# Altium schematic sheet Sens.SchDoc
size A4
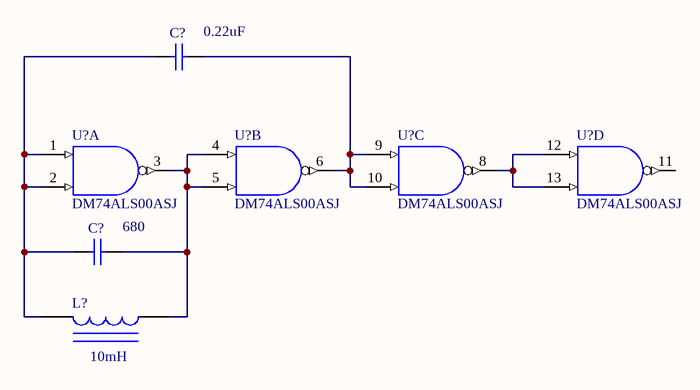
[diagram p0: Sens.SchDoc]

## Parts
(Parts that share a designator on the sheet are numbered #1, #2 ... from top to bottom, then left to right.)
C?#1  value 0.22uF  [RAD-0.3]  (hidden comment: Cap)
C?#2  value 680  [RAD-0.3]  (hidden comment: Cap)
L?  value 10mH  [AXIAL-0.9]  (hidden comment: Inductor Iron)
U?#1  DM74ALS00ASJ  [M14D_N]  (part A of 4)
U?#2  DM74ALS00ASJ  [M14D_N]  (part B of 4)
U?#3  DM74ALS00ASJ  [M14D_N]  (part C of 4)
U?#4  DM74ALS00ASJ  [M14D_N]  (part D of 4)

## Nets
GND: U?#1.7(GND) U?#2.7(GND) U?#3.7(GND) U?#4.7(GND)
VCC: U?#1.14(VCC) U?#2.14(VCC) U?#3.14(VCC) U?#4.14(VCC)
NetC?#1_1: C?#1.1 U?#2.6(Y) U?#3.9(A) U?#3.10(B)
NetC?#1_2: C?#1.2 C?#2.2 L?.2 U?#1.1(A) U?#1.2(B)
NetC?#2_1: C?#2.1 L?.1 U?#1.3(Y) U?#2.4(A) U?#2.5(B)
NetU?#3_8: U?#3.8(Y) U?#4.12(A) U?#4.13(B)

Not connected (* = marked no-connect by the designer): U?#4 11(Y)

## Library data of the parts
C?#1 C?#2 = Cap: Capacitor; Published: 8-Jun-2000; LatestRevisionDate: 17-Jul-2002; LatestRevisionNote: Re-released for DXP Platform.; PackageReference: RAD-0.3; Publisher: Altium Limited; PackageDescription: Radial Cap, Thru-Hole; 2 Leads; 0.3 in Pin Spacing
L? = Inductor Iron: Magnetic-Core Inductor; Published: 24-Mar-1999; LatestRevisionDate: 17-Jul-2002; LatestRevisionNote: Re-released for DXP Platform.; PackageReference: AXIAL-0.9; Publisher: Altium Limited; PackageDescription: Axial Device, Thru-Hole; 2 Leads; 0.9 in Pin Spacing
U?#1-U?#4 = DM74ALS00ASJ: Quad 2-Input NAND Gate, 14-Pin SOP, Commerical Grade; IC_Technology: ALS; Published: 17-Jul-2002; LatestRevisionDate: 13-Apr-2006; LatestRevisionNote: IPC-7351 Footprint Added.; DatasheetVersion: Feb-1998; PackageVersion: 2000; PackageReference: M14D; Publisher: Altium Limited; PackageDescription: 14-Pin Small Outline Package 1.27 mm Pitch; ComponentLink1Description: Manufacturer Link; ComponentLink1URL: http://www.fairchildsemi.com/; ComponentLink2Description: Datasheet; ComponentLink2URL: http://www.fairchildsemi.com/ds/DM%2FDM74ALS00A.pdf